# EAGLE schematic AK4493-Combi9 (EAGLE 9.6.2)
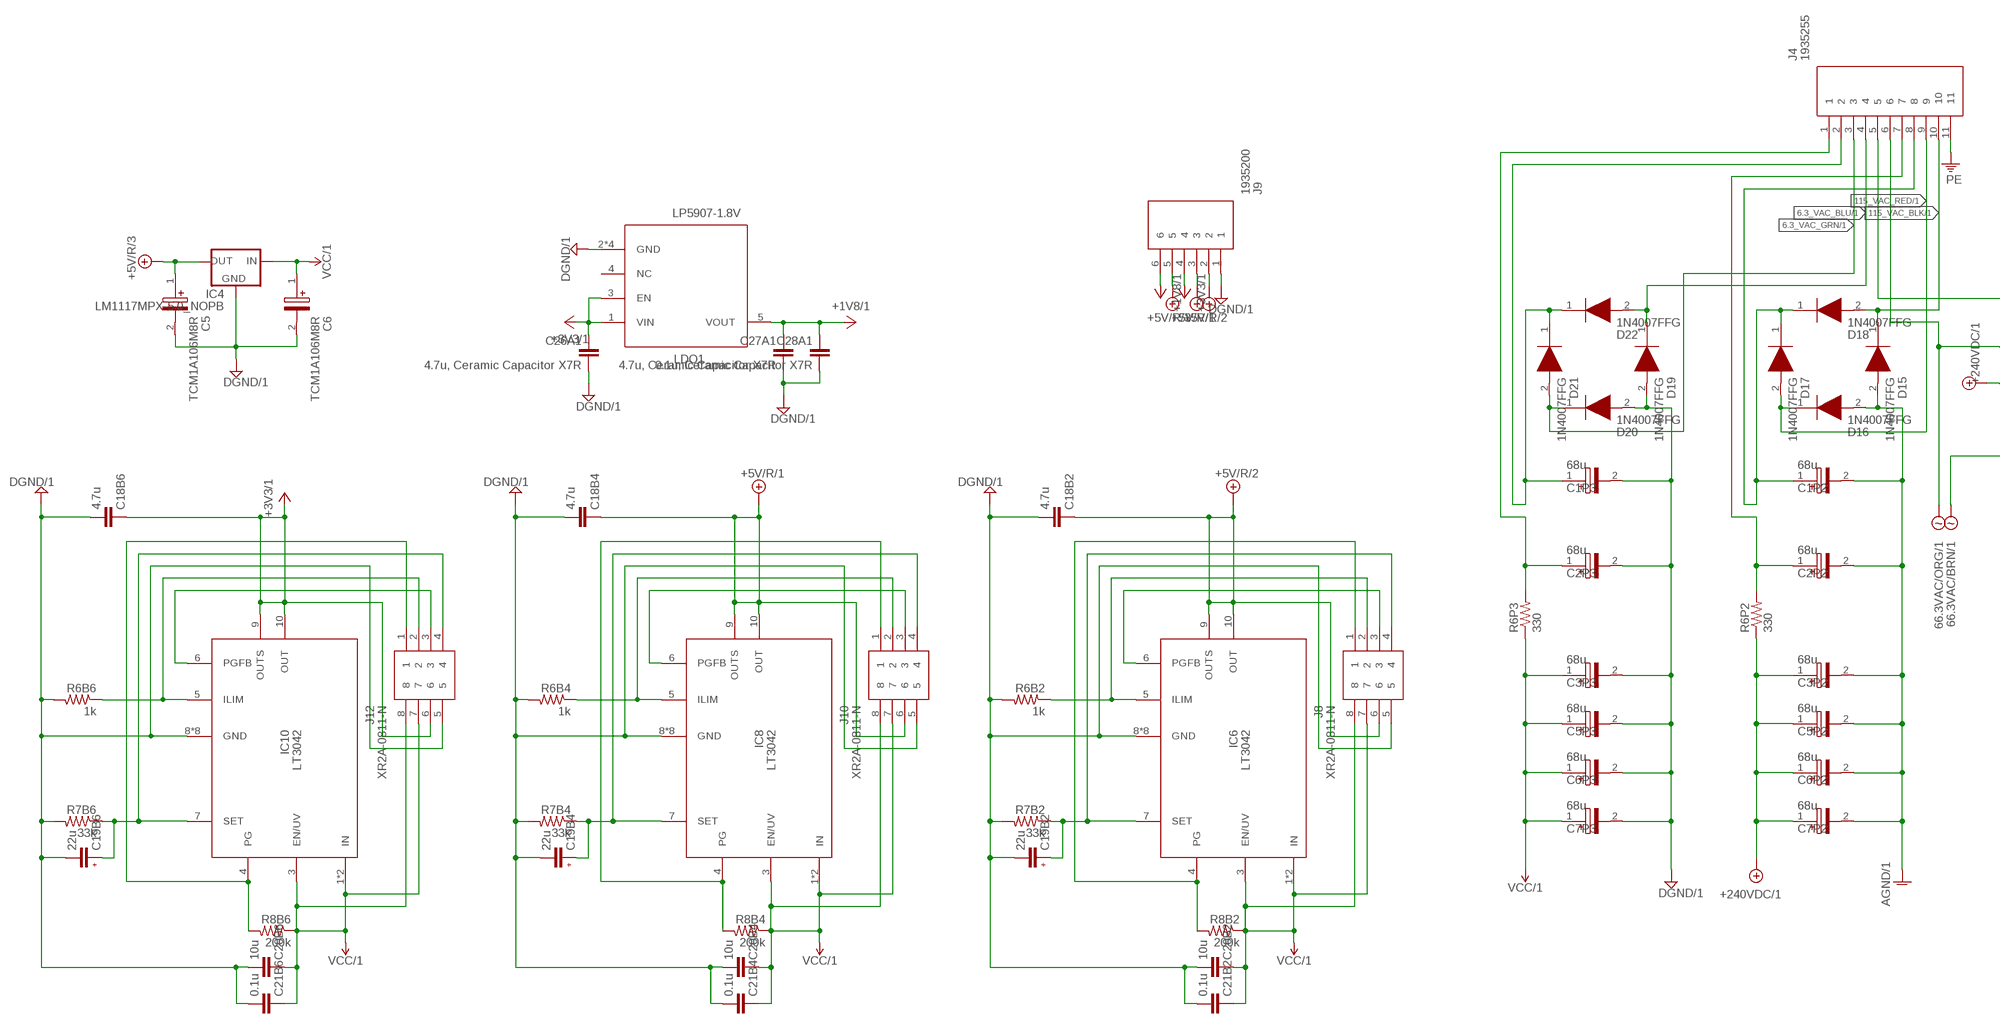
[diagram p0: schematic, sheet 1, part 1 of 3]
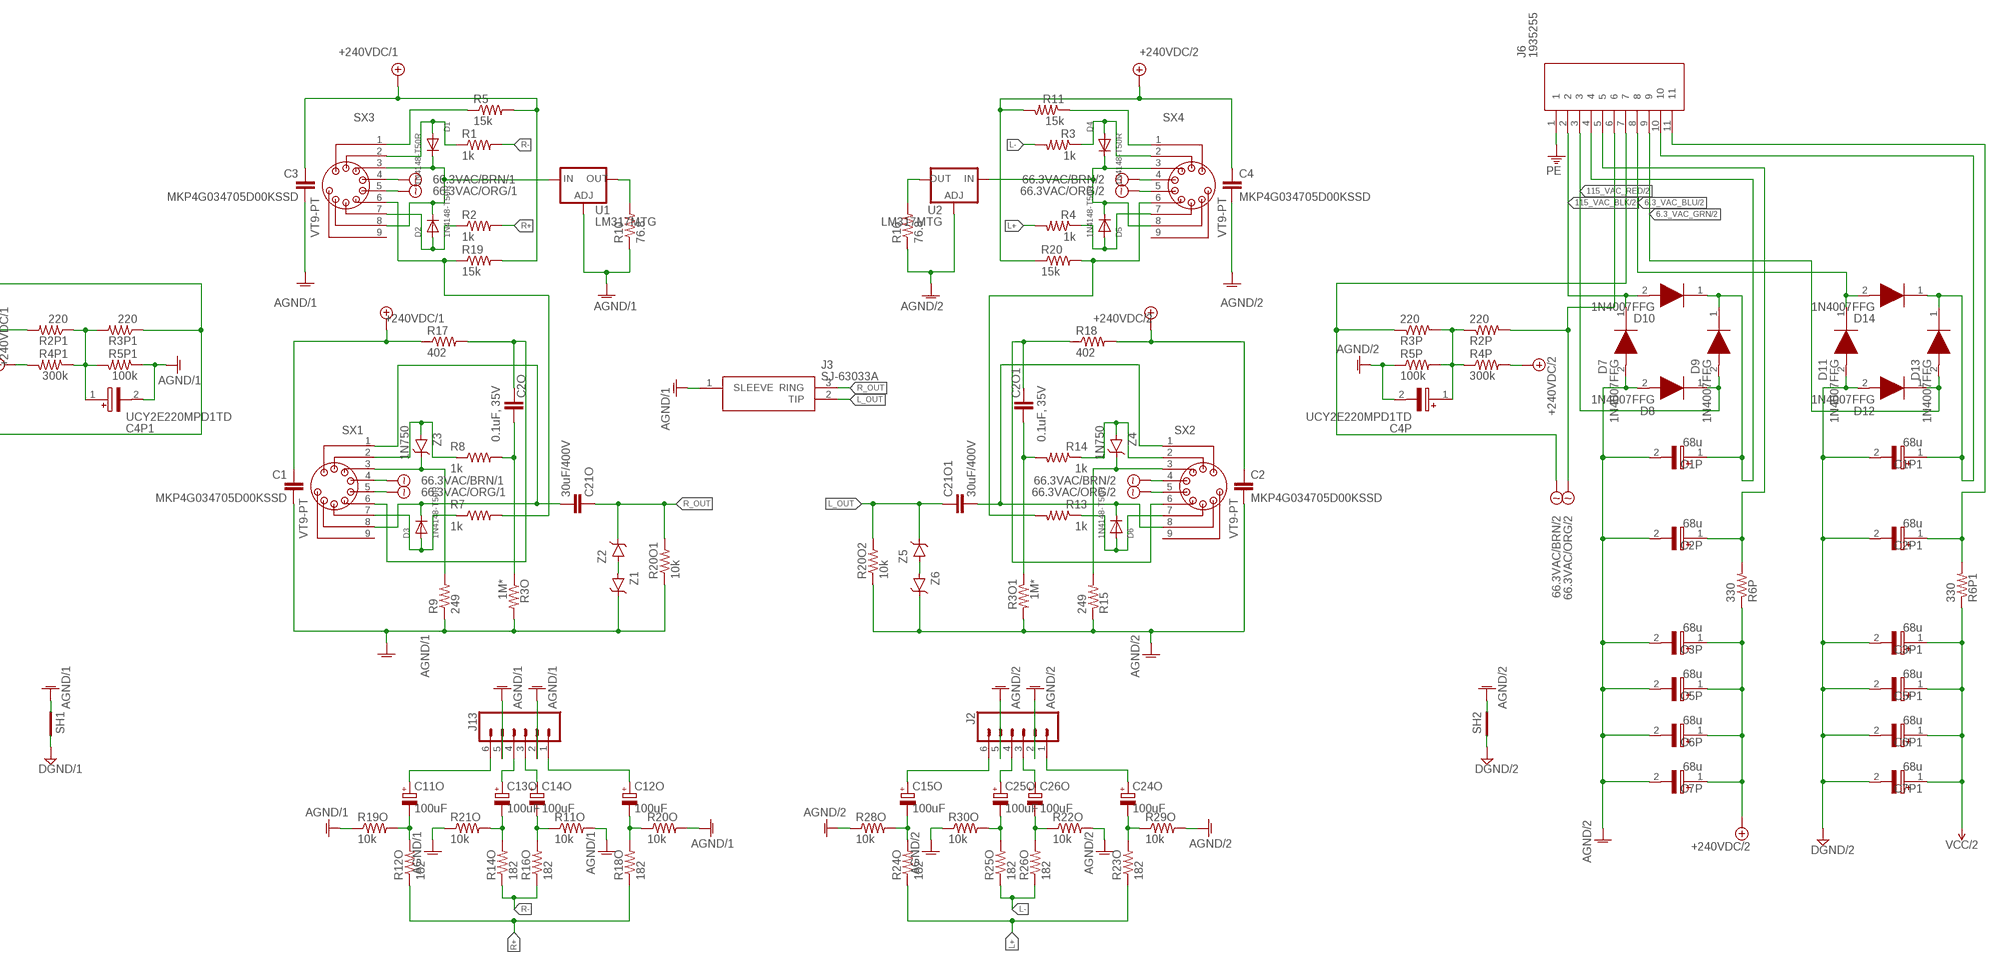
[diagram p1: schematic, sheet 1, part 2 of 3]
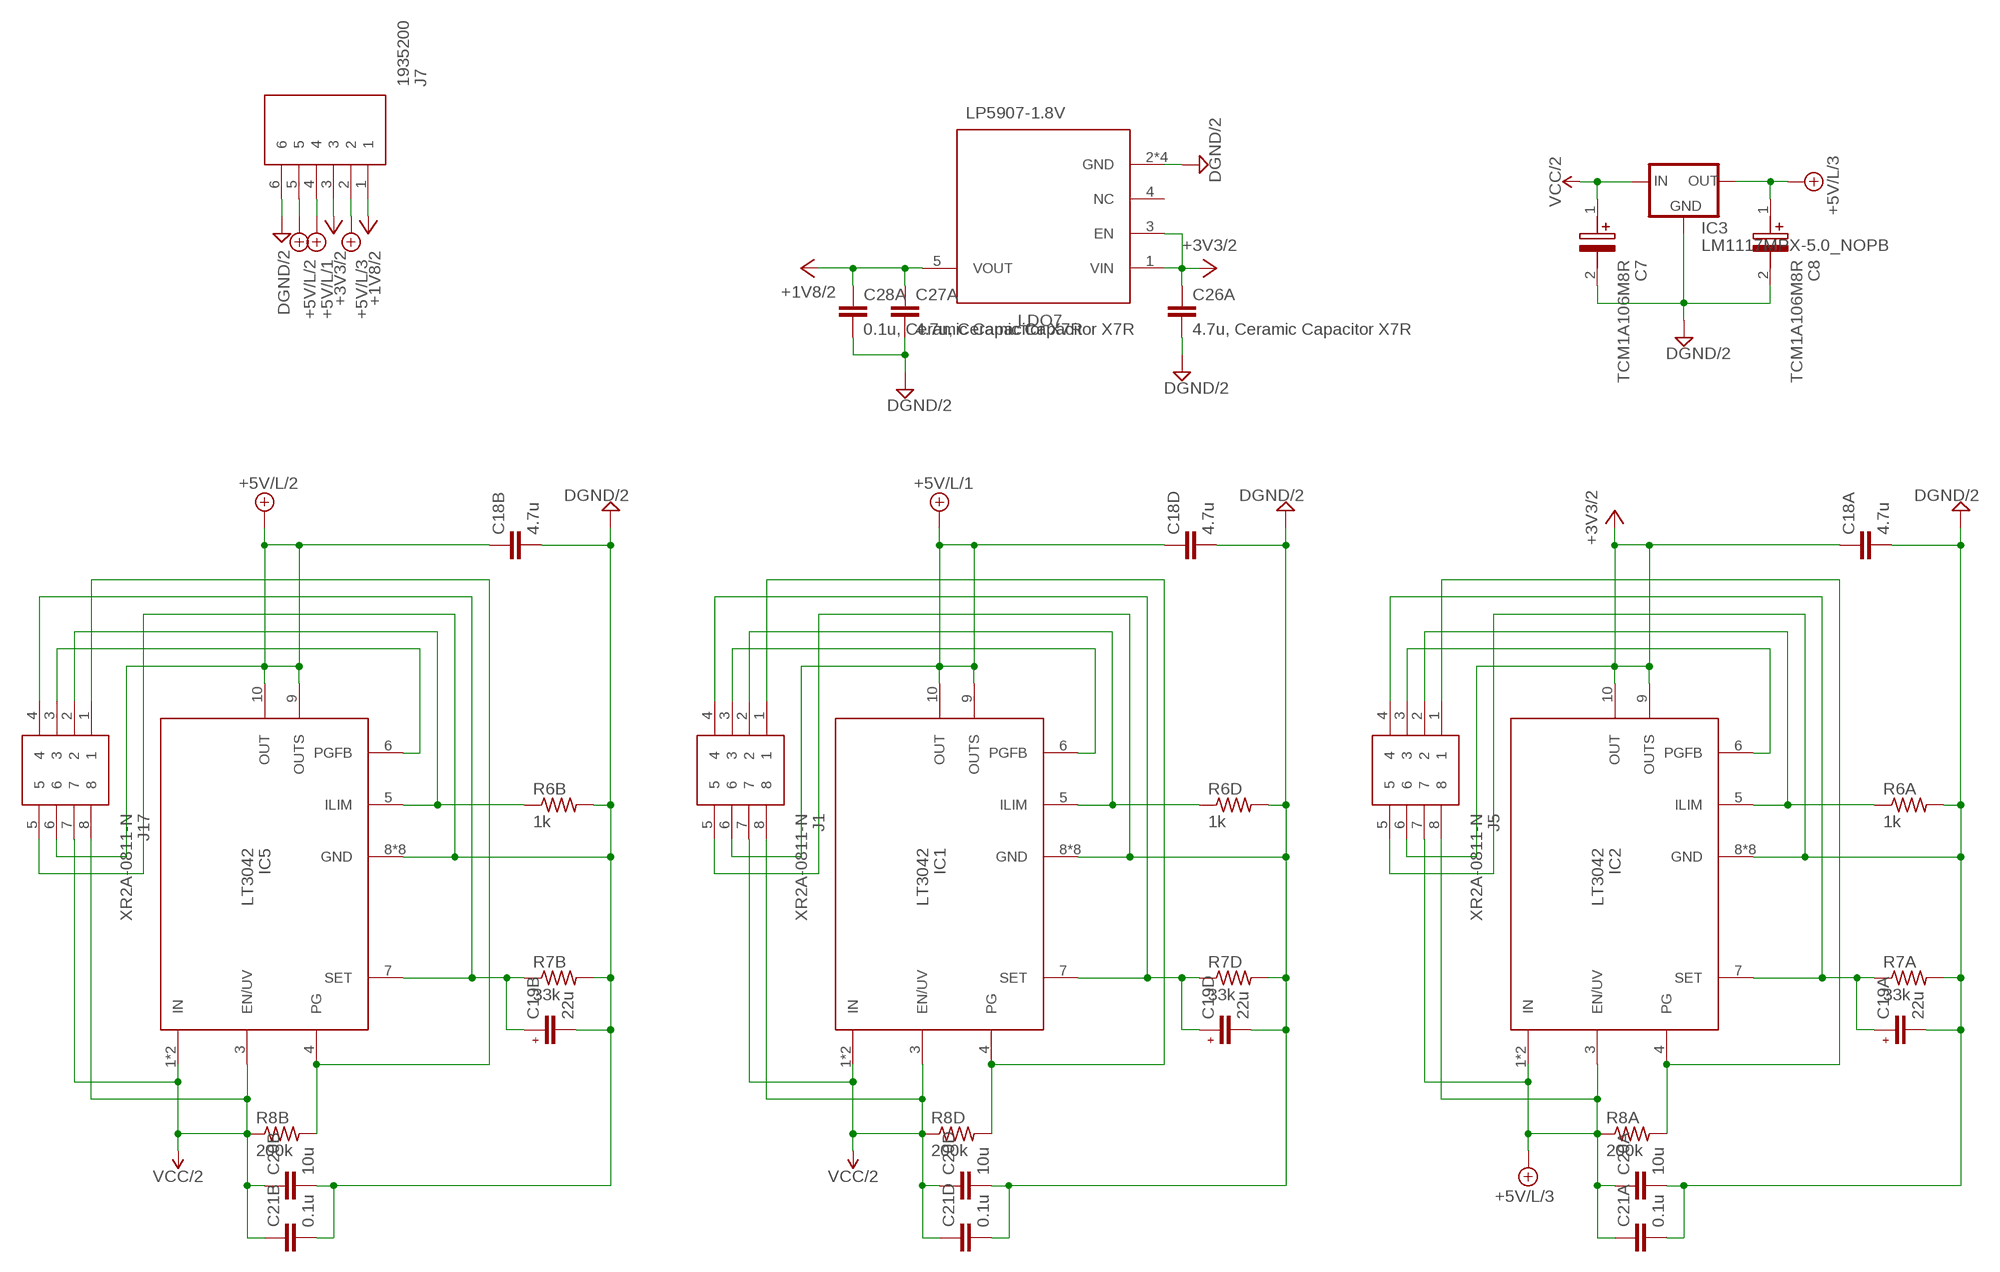
[diagram p2: schematic, sheet 1, part 3 of 3]

## Parts
C1  MKP4G034705D00KSSD  [MKP4G034705D00KSSD]
C1P  68u  500HXW68MEFR14.5X45  [CAPPRD750W80D1475H4700]
C1P1  68u  500HXW68MEFR14.5X45  [CAPPRD750W80D1475H4700]
C1P2  68u  500HXW68MEFR14.5X45  [CAPPRD750W80D1475H4700]
C1P3  68u  500HXW68MEFR14.5X45  [CAPPRD750W80D1475H4700]
C2  MKP4G034705D00KSSD  [MKP4G034705D00KSSD]
C2O  0.1uF, 35V  MKS4B031002A00JC00  [MKS4B031002A00JC00]
C2O1  0.1uF, 35V  MKS4B031002A00JC00  [MKS4B031002A00JC00]
C2P  68u  500HXW68MEFR14.5X45  [CAPPRD750W80D1475H4700]
C2P1  68u  500HXW68MEFR14.5X45  [CAPPRD750W80D1475H4700]
C2P2  68u  500HXW68MEFR14.5X45  [CAPPRD750W80D1475H4700]
C2P3  68u  500HXW68MEFR14.5X45  [CAPPRD750W80D1475H4700]
C3  MKP4G034705D00KSSD  [MKP4G034705D00KSSD]
C3P  68u  500HXW68MEFR14.5X45  [CAPPRD750W80D1475H4700]
C3P1  68u  500HXW68MEFR14.5X45  [CAPPRD750W80D1475H4700]
C3P2  68u  500HXW68MEFR14.5X45  [CAPPRD750W80D1475H4700]
C3P3  68u  500HXW68MEFR14.5X45  [CAPPRD750W80D1475H4700]
C4  MKP4G034705D00KSSD  [MKP4G034705D00KSSD]
C4P  UCY2E220MPD1TD  [CAPPRD500W60D1025H1750]
C4P1  UCY2E220MPD1TD  [CAPPRD500W60D1025H1750]
C5  TCM1A106M8R  [CAPPM168X90N]
C5P  68u  500HXW68MEFR14.5X45  [CAPPRD750W80D1475H4700]
C5P1  68u  500HXW68MEFR14.5X45  [CAPPRD750W80D1475H4700]
C5P2  68u  500HXW68MEFR14.5X45  [CAPPRD750W80D1475H4700]
C5P3  68u  500HXW68MEFR14.5X45  [CAPPRD750W80D1475H4700]
C6  TCM1A106M8R  [CAPPM168X90N]
C6P  68u  500HXW68MEFR14.5X45  [CAPPRD750W80D1475H4700]
C6P1  68u  500HXW68MEFR14.5X45  [CAPPRD750W80D1475H4700]
C6P2  68u  500HXW68MEFR14.5X45  [CAPPRD750W80D1475H4700]
C6P3  68u  500HXW68MEFR14.5X45  [CAPPRD750W80D1475H4700]
C7  TCM1A106M8R  [CAPPM168X90N]
C7P  68u  500HXW68MEFR14.5X45  [CAPPRD750W80D1475H4700]
C7P1  68u  500HXW68MEFR14.5X45  [CAPPRD750W80D1475H4700]
C7P2  68u  500HXW68MEFR14.5X45  [CAPPRD750W80D1475H4700]
C7P3  68u  500HXW68MEFR14.5X45  [CAPPRD750W80D1475H4700]
C8  TCM1A106M8R  [CAPPM168X90N]
C11O  100uF  UFW1H101MPD1TD  [CAPPRD350W60D825H1300]
C12O  100uF  UFW1H101MPD1TD  [CAPPRD350W60D825H1300]
C13O  100uF  UFW1H101MPD1TD  [CAPPRD350W60D825H1300]
C14O  100uF  UFW1H101MPD1TD  [CAPPRD350W60D825H1300]
C15O  100uF  UFW1H101MPD1TD  [CAPPRD350W60D825H1300]
C18A  4.7u  EMK212ABJ475KG-T  [CAPC2013X140N]
C18B  4.7u  EMK212ABJ475KG-T  [CAPC2013X140N]
C18B2  4.7u  EMK212ABJ475KG-T  [CAPC2013X140N]
C18B4  4.7u  EMK212ABJ475KG-T  [CAPC2013X140N]
C18B6  4.7u  EMK212ABJ475KG-T  [CAPC2013X140N]
C18D  4.7u  EMK212ABJ475KG-T  [CAPC2013X140N]
C19A  22u  EMK316BB7226ML-T  [C1206]
C19B  22u  EMK316BB7226ML-T  [C1206]
C19B2  22u  EMK316BB7226ML-T  [C1206]
C19B4  22u  EMK316BB7226ML-T  [C1206]
C19B6  22u  EMK316BB7226ML-T  [C1206]
C19D  22u  EMK316BB7226ML-T  [C1206]
C20A  10u  EMK212BB7106KG-T  [CAPC2012X135N]
C20B  10u  EMK212BB7106KG-T  [CAPC2012X135N]
C20B2  10u  EMK212BB7106KG-T  [CAPC2012X135N]
C20B4  10u  EMK212BB7106KG-T  [CAPC2012X135N]
C20B6  10u  EMK212BB7106KG-T  [CAPC2012X135N]
C20D  10u  EMK212BB7106KG-T  [CAPC2012X135N]
C21A  0.1u  EMF212B7104KGHT  [CAPC2012X135N]
C21B  0.1u  EMF212B7104KGHT  [CAPC2012X135N]
C21B2  0.1u  EMF212B7104KGHT  [CAPC2012X135N]
C21B4  0.1u  EMF212B7104KGHT  [CAPC2012X135N]
C21B6  0.1u  EMF212B7104KGHT  [CAPC2012X135N]
C21D  0.1u  EMF212B7104KGHT  [CAPC2012X135N]
C21O  30uF/400V  DCP4G056007GD4KSSD  [DCP4G056007GD4KSSD]
C21O1  30uF/400V  DCP4G056007GD4KSSD  [DCP4G056007GD4KSSD]
C24O  100uF  UFW1H101MPD1TD  [CAPPRD350W60D825H1300]
C25O  100uF  UFW1H101MPD1TD  [CAPPRD350W60D825H1300]
C26A  4.7u, Ceramic Capacitor X7R  EMK212ABJ475KG-T  [CAPC2013X140N]
C26A1  4.7u, Ceramic Capacitor X7R  EMK212ABJ475KG-T  [CAPC2013X140N]
C26O  100uF  UFW1H101MPD1TD  [CAPPRD350W60D825H1300]
C27A  4.7u, Ceramic Capacitor X7R  EMK212ABJ475KG-T  [CAPC2013X140N]
C27A1  4.7u, Ceramic Capacitor X7R  EMK212ABJ475KG-T  [CAPC2013X140N]
C28A  0.1u, Ceramic Capacitor X7R  EMF212B7104KGHT  [CAPC2012X135N]
C28A1  0.1u, Ceramic Capacitor X7R  EMF212B7104KGHT  [CAPC2012X135N]
D1  1N4148-T50R  [DIOAD1068W53L380D172]
D2  1N4148-T50R  [DIOAD1068W53L380D172]
D3  1N4148-T50R  [DIOAD1068W53L380D172]
D4  1N4148-T50R  [DIOAD1068W53L380D172]
D5  1N4148-T50R  [DIOAD1068W53L380D172]
D6  1N4148-T50R  [DIOAD1068W53L380D172]
D7  1N4007FFG  [DIOAD1405W86L465D235]
D8  1N4007FFG  [DIOAD1405W86L465D235]
D9  1N4007FFG  [DIOAD1405W86L465D235]
D10  1N4007FFG  [DIOAD1405W86L465D235]
D11  1N4007FFG  [DIOAD1405W86L465D235]
D12  1N4007FFG  [DIOAD1405W86L465D235]
D13  1N4007FFG  [DIOAD1405W86L465D235]
D14  1N4007FFG  [DIOAD1405W86L465D235]
D15  1N4007FFG  [DIOAD1405W86L465D235]
D16  1N4007FFG  [DIOAD1405W86L465D235]
D17  1N4007FFG  [DIOAD1405W86L465D235]
D18  1N4007FFG  [DIOAD1405W86L465D235]
D19  1N4007FFG  [DIOAD1405W86L465D235]
D20  1N4007FFG  [DIOAD1405W86L465D235]
D21  1N4007FFG  [DIOAD1405W86L465D235]
D22  1N4007FFG  [DIOAD1405W86L465D235]
IC1  LT3042  [SOP50P490X110-11N]
IC2  LT3042  [SOP50P490X110-11N]
IC3  LM1117MPX-5.0_NOPB  [SOT230P700X180-4N]
IC4  LM1117MPX-5.0_NOPB  [SOT230P700X180-4N]
IC5  LT3042  [SOP50P490X110-11N]
IC6  LT3042  [SOP50P490X110-11N]
IC8  LT3042  [SOP50P490X110-11N]
IC10  LT3042  [SOP50P490X110-11N]
J1  XR2A-0811-N  [DIPS762W51P254L1016H390Q8N]
J2  CONN_06SILK_FEMALE_PTH  [1X06]
J3  SJ-63033A  [SJ63033A]
J4  1935255  [1935255]
J5  XR2A-0811-N  [DIPS762W51P254L1016H390Q8N]
J6  1935255  [1935255]
J7  1935200  [1935200]
J8  XR2A-0811-N  [DIPS762W51P254L1016H390Q8N]
J9  1935200  [1935200]
J10  XR2A-0811-N  [DIPS762W51P254L1016H390Q8N]
J12  XR2A-0811-N  [DIPS762W51P254L1016H390Q8N]
J13  CONN_06SILK_FEMALE_PTH  [1X06]
J17  XR2A-0811-N  [DIPS762W51P254L1016H390Q8N]
LDO1  LP5907-1.8V  [SOT95P280X145-5N]
LDO7  LP5907-1.8V  [SOT95P280X145-5N]
R1  1k  LR1F1K0  [0207/10]
R2  1k  LR1F1K0  [0207/10]
R2P  220  R-US_0411/15  [0411/15]
R2P1  220  R-US_0411/15  [0411/15]
R3  1k  LR1F1K0  [0207/10]
R3O  1M*  LR1F1M0  [0207/10]
R3O1  1M*  LR1F1M0  [0207/10]
R3P  220  R-US_0411/15  [0411/15]
R3P1  220  R-US_0411/15  [0411/15]
R4  1k  LR1F1K0  [0207/10]
R4P  300k  R-US_0411/15  [0411/15]
R4P1  300k  R-US_0411/15  [0411/15]
R5  15k  CPF215K000FKE14  [0411/15]
R5P  100k  R-US_0411/15  [0411/15]
R5P1  100k  R-US_0411/15  [0411/15]
R6A  1k  CHP0805-FX-1001ELF  [RESC2012X60N]
R6B  1k  CHP0805-FX-1001ELF  [RESC2012X60N]
R6B2  1k  CHP0805-FX-1001ELF  [RESC2012X60N]
R6B4  1k  CHP0805-FX-1001ELF  [RESC2012X60N]
R6B6  1k  CHP0805-FX-1001ELF  [RESC2012X60N]
R6D  1k  CHP0805-FX-1001ELF  [RESC2012X60N]
R6P  330  R-US_0411/15  [0411/15]
R6P1  330  R-US_0411/15  [0411/15]
R6P2  330  R-US_0411/15  [0411/15]
R6P3  330  R-US_0411/15  [0411/15]
R7  1k  LR1F1K0  [0207/10]
R7A  33k  CPF0805B51KE1  [R0805]
R7B  33k  CPF0805B51KE1  [R0805]
R7B2  33k  CPF0805B51KE1  [R0805]
R7B4  33k  CPF0805B51KE1  [R0805]
R7B6  33k  CPF0805B51KE1  [R0805]
R7D  33k  CPF0805B51KE1  [R0805]
R8  1k  LR1F1K0  [0207/10]
R8A  200k  RR1220P-204-D  [R0805]
R8B  200k  RR1220P-204-D  [R0805]
R8B2  200k  RR1220P-204-D  [R0805]
R8B4  200k  RR1220P-204-D  [R0805]
R8B6  200k  RR1220P-204-D  [R0805]
R8D  200k  RR1220P-204-D  [R0805]
R9  249  MBB02070C2490FRP00  [0207/10]
R10  76.8  YR1B76R8CC  [0207/10]
R11  15k  CPF215K000FKE14  [0411/15]
R11O  10k  LR1F10K  [0207/10]
R12O  182  MF0207FTE52-182R  [0207/10]
R13  1k  LR1F1K0  [0207/10]
R14  1k  LR1F1K0  [0207/10]
R14O  182  MF0207FTE52-182R  [0207/10]
R15  249  MBB02070C2490FRP00  [0207/10]
R16  76.8  YR1B76R8CC  [0207/10]
R16O  182  MF0207FTE52-182R  [0207/10]
R17  402  RWR80S4020FRB12  [0617/22]
R18  402  RWR80S4020FRB12  [0617/22]
R18O  182  MF0207FTE52-182R  [0207/10]
R19  15k  CPF215K000FKE14  [0411/15]
R19O  10k  LR1F10K  [0207/10]
R20  15k  CPF215K000FKE14  [0411/15]
R20O  10k  LR1F10K  [0207/10]
R20O1  10k  LR1F10K  [0207/10]
R20O2  10k  LR1F10K  [0207/10]
R21O  10k  LR1F10K  [0207/10]
R22O  10k  LR1F10K  [0207/10]
R23O  182  MF0207FTE52-182R  [0207/10]
R24O  182  MF0207FTE52-182R  [0207/10]
R25O  182  MF0207FTE52-182R  [0207/10]
R26O  182  MF0207FTE52-182R  [0207/10]
R28O  10k  LR1F10K  [0207/10]
R29O  10k  LR1F10K  [0207/10]
R30O  10k  LR1F10K  [0207/10]
SH1  SHORTA5  [SHORT_ALL-50]
SH2  SHORTA5  [SHORT_ALL-50]
SX1  VT9-PT  [VT9-PT]
SX2  VT9-PT  [VT9-PT]
SX3  VT9-PT  [VT9-PT]
SX4  VT9-PT  [VT9-PT]
U1  LM317MTG  [TO254P482X997X2018-3P]
U2  LM317MTG  [TO254P482X997X2018-3P]
Z1  BZX79-C16,113  [DIOAD1165W56L425D185]
Z2  BZX79-C16,113  [DIOAD1165W56L425D185]
Z3  1N750  [DIOAD1256W56L444D203]
Z4  1N750  [DIOAD1256W56L444D203]
Z5  BZX79-C16,113  [DIOAD1165W56L425D185]
Z6  BZX79-C16,113  [DIOAD1165W56L425D185]

## Nets
6.3_VAC_BLU/1: D19.1(K) D22.2(A) J4.4
6.3_VAC_BLU/2: D11.1(K) D14.2(A) J6.8
6.3_VAC_GRN/1: D20.1(K) D21.2(A) J4.3
6.3_VAC_GRN/2: D12.1(K) D13.2(A) J6.9
66.3VAC/BRN/1: J4.5 R3P1.1 SX1.4 SX3.4
66.3VAC/BRN/2: J6.7 R3P.1 SX2.4 SX4.4
66.3VAC/ORG/1: J4.6 R2P1.2 SX1.5 SX3.5
66.3VAC/ORG/2: J6.6 R2P.2 SX2.5 SX4.5
115_VAC_BLK/1: D15.1(K) D18.2(A) J4.10
115_VAC_BLK/2: D7.1(K) D10.2(A) J6.2
115_VAC_RED/1: D16.1(K) D17.2(A) J4.9
115_VAC_RED/2: D8.1(K) D9.2(A) J6.3
+1V8/1: C27A1.1 C28A1.1 J9.6 LDO1.5(VOUT)
+1V8/2: C27A.1 C28A.1 J7.1 LDO7.5(VOUT)
+3V3/1: C18B6.1 C26A1.1 IC10.9(OUTS) IC10.10(OUT) J9.4 J12.6 LDO1.1(VIN) LDO1.3(EN)
+3V3/2: C18A.1 C26A.1 IC2.9(OUTS) IC2.10(OUT) J5.6 J7.3 LDO7.1(VIN) LDO7.3(EN)
+5V/L/1: C18D.1 IC1.9(OUTS) IC1.10(OUT) J1.6 J7.4
+5V/L/2: C18B.1 IC5.9(OUTS) IC5.10(OUT) J7.5 J17.6
+5V/L/3: C8.1(+) C20A.1 C21A.1 IC2.1(IN) IC2.2(IN) IC2.3(EN/UV) IC3.2(OUT) IC3.4(OUT) J5.7 J5.8 J7.2 R8A.1
+5V/R/1: C18B4.1 IC8.9(OUTS) IC8.10(OUT) J9.3 J10.6
+5V/R/2: C18B2.1 IC6.9(OUTS) IC6.10(OUT) J8.6 J9.2
+5V/R/3: C5.1(+) IC4.2(OUT) IC4.4(OUT) J9.5
+240VDC/1: C1.1 C3.1 C3P2.1(+) C5P2.1(+) C6P2.1(+) C7P2.1(+) R4P1.2 R5.2 R6P2.1 R17.1 R19.2
+240VDC/2: C2.1 C3P.1(+) C4.1 C5P.1(+) C6P.1(+) C7P.1(+) R4P.2 R6P.1 R11.2 R18.2 R20.1
AGND/1: C1.2 C1P2.2(-) C2P2.2(-) C3.2 C3P2.2(-) C4P1.2(-) C5P2.2(-) C6P2.2(-) C7P2.2(-) D15.2(A) D16.2(A) J3.1(SLEEVE) J13.2 J13.5 R3O.2 R5P1.1 R9.1 R10.1 R11O.2 R19O.1 R20O1.1 R20O.2 R21O.1 SH1.2 U1.1(ADJ) Z1.1(C)
AGND/2: C1P.2(-) C2.2 C2P.2(-) C3P.2(-) C4.2 C4P.2(-) C5P.2(-) C6P.2(-) C7P.2(-) D7.2(A) D8.2(A) J2.2 J2.5 R3O1.2 R5P.1 R15.1 R16.1 R20O2.1 R22O.2 R28O.1 R29O.2 R30O.1 SH2.2 U2.1(ADJ) Z6.1(C)
DGND/1: C1P3.2(-) C2P3.2(-) C3P3.2(-) C5.2(-) C5P3.2(-) C6.2(-) C6P3.2(-) C7P3.2(-) C18B2.2 C18B4.2 C18B6.2 C19B2.2 C19B2.DGND C19B4.2 C19B4.DGND C19B6.2 C19B6.DGND C20B2.2 C20B4.2 C20B6.2 C21B2.2 C21B4.2 C21B6.2 C26A1.2 C27A1.2 C28A1.2 D19.2(A) D20.2(A) IC4.1(GND) IC6.8(GND) IC6.11(GND) IC6.P$1(GND) IC6.P$2(GND) IC6.P$3(GND) IC6.P$4(GND) IC6.P$5(GND) IC6.P$6(GND) IC8.8(GND) IC8.11(GND) IC8.P$1(GND) IC8.P$2(GND) IC8.P$3(GND) IC8.P$4(GND) IC8.P$5(GND) IC8.P$6(GND) IC10.8(GND) IC10.11(GND) IC10.P$1(GND) IC10.P$2(GND) IC10.P$3(GND) IC10.P$4(GND) IC10.P$5(GND) IC10.P$6(GND) J8.5 J9.1 J10.5 J12.5 LDO1.2(GND) LDO1.DGND2(GND) LDO1.DGND3(GND) LDO1.DGND(GND) R6B2.2 R6B4.2 R6B6.2 R7B2.2 R7B4.2 R7B6.2 SH1.1
DGND/2: C1P1.2(-) C2P1.2(-) C3P1.2(-) C5P1.2(-) C6P1.2(-) C7.2(-) C7P1.2(-) C8.2(-) C18A.2 C18B.2 C18D.2 C19A.2 C19A.DGND C19B.2 C19B.DGND C19D.2 C19D.DGND C20A.2 C20B.2 C20D.2 C21A.2 C21B.2 C21D.2 C26A.2 C27A.2 C28A.2 D11.2(A) D12.2(A) IC1.8(GND) IC1.11(GND) IC1.P$1(GND) IC1.P$2(GND) IC1.P$3(GND) IC1.P$4(GND) IC1.P$5(GND) IC1.P$6(GND) IC2.8(GND) IC2.11(GND) IC2.P$1(GND) IC2.P$2(GND) IC2.P$3(GND) IC2.P$4(GND) IC2.P$5(GND) IC2.P$6(GND) IC3.1(GND) IC5.8(GND) IC5.11(GND) IC5.P$1(GND) IC5.P$2(GND) IC5.P$3(GND) IC5.P$4(GND) IC5.P$5(GND) IC5.P$6(GND) J1.5 J5.5 J7.6 J17.5 LDO7.2(GND) LDO7.DGND2(GND) LDO7.DGND3(GND) LDO7.DGND(GND) R6A.2 R6B.2 R6D.2 R7A.2 R7B.2 R7D.2 SH2.1
L+ [Signal]: R4.2 R23O.1 R24O.1
L- [Signal]: R3.2 R25O.1 R26O.1
L_OUT [Signal]: C21O1.1 C21O1.4 J3.2(TIP) R20O2.2 Z5.1(C)
N$1: R7.2 R19.1 SX3.6
N$2: R8.1 SX1.2 Z3.2(A)
N$3: C21O1.2 C21O1.3 D6.1(C) SX2.1 SX2.8
N$4: D4.2(A) R3.1 SX4.2
N$5: D5.2(A) R4.1 SX4.7
N$6: D1.2(A) R1.1 SX3.2
N$7 [Power]: D4.1(C) D5.1(C) SX4.3 SX4.8 U2.3(IN)
N$8: R11.1 SX4.1
N$9: R13.2 R20.2 SX4.6
N$10: C11O.1(+) J13.6
N$11: C11O.2(-) R12O.2 R19O.2
N$12: C15O.1(+) J2.6
N$13: D2.2(A) R2.1 SX3.7
N$14: R14.1 SX2.2 Z4.2(A)
N$15: C12O.1(+) J13.1
N$16: C2O.2 R3O.1 R8.2
N$17: C2O1.2 R3O1.1 R14.2
N$18: C21O.2 C21O.3 D3.1(C) SX1.1 SX1.8
N$19: C12O.2(-) R18O.2 R20O.1
N$20: C15O.2(-) R24O.2 R28O.2
N$21: C13O.1(+) J13.4
N$22 [Power]: D1.1(C) D2.1(C) SX3.3 SX3.8 U1.3(IN)
N$23: D3.2(A) R7.1 SX1.7
N$24: C14O.1(+) J13.3
N$25: C14O.2(-) R11O.1 R16O.2
N$26: R9.2 SX1.3 Z3.1(C)
N$27: R15.2 SX2.3 Z4.1(C)
N$28: C13O.2(-) R14O.2 R21O.2
N$29: D6.2(A) R13.1 SX2.7
N$30: C24O.1(+) J2.1
N$31: C24O.2(-) R23O.2 R29O.1
N$32: C25O.1(+) J2.4
N$33: C26O.1(+) J2.3
N$34: C26O.2(-) R22O.1 R26O.2
N$35: R5.1 SX3.1
N$36: C25O.2(-) R25O.2 R30O.2
N$37: R10.2 U1.2(OUT)
N$38: R16.2 U2.2(OUT)
N$39 [Power]: C2O.1 R17.2 SX1.6
N$40 [Power]: C2O1.1 R18.1 SX2.6
N$41: Z1.2(A) Z2.2(A)
N$42: Z5.2(A) Z6.2(A)
N$43: C1P.1(+) D9.1(K) D10.1(K) J6.4
N$44: C2P.1(+) J6.5 R6P.2
N$45: C4P.1(+) R2P.1 R3P.2 R4P.1 R5P.2
N$46: IC5.4(PG) J17.1 R8B.2
N$47: IC5.5(ILIM) J17.2 R6B.1
N$48: IC5.6(PGFB) J17.3
N$49: IC1.4(PG) J1.1 R8D.2
N$50: IC1.5(ILIM) J1.2 R6D.1
N$51: IC1.6(PGFB) J1.3
N$52: C19D.1 IC1.7(SET) J1.4 R7D.1
N$53: IC2.4(PG) J5.1 R8A.2
N$54: IC2.5(ILIM) J5.2 R6A.1
N$55: IC2.6(PGFB) J5.3
N$56: C19A.1 IC2.7(SET) J5.4 R7A.1
N$57: C1P1.1(+) D13.1(K) D14.1(K) J6.10
N$58: C2P1.1(+) J6.11 R6P1.2
N$59: C1P2.1(+) D17.1(K) D18.1(K) J4.8
N$60: C2P2.1(+) J4.7 R6P2.2
N$61: C4P1.1(+) R2P1.1 R3P1.2 R4P1.1 R5P1.2
N$62: C1P3.1(+) D21.1(K) D22.1(K) J4.2
N$63: IC6.4(PG) J8.1 R8B2.2
N$64: C19B2.1 IC6.7(SET) J8.4 R7B2.1
N$65: IC6.5(ILIM) J8.2 R6B2.1
N$66: IC6.6(PGFB) J8.3
N$67: C2P3.1(+) J4.1 R6P3.2
N$71: IC8.4(PG) J10.1 R8B4.2
N$72: C19B4.1 IC8.7(SET) J10.4 R7B4.1
N$73: IC8.5(ILIM) J10.2 R6B4.1
N$74: IC8.6(PGFB) J10.3
N$79: IC10.4(PG) J12.1 R8B6.2
N$80: C19B6.1 IC10.7(SET) J12.4 R7B6.1
N$81: IC10.5(ILIM) J12.2 R6B6.1
N$82: IC10.6(PGFB) J12.3
N$103: C19B.1 IC5.7(SET) J17.4 R7B.1
PE: J4.11 J6.1
R+ [Signal]: R2.2 R12O.1 R18O.1
R- [Signal]: R1.2 R14O.1 R16O.1
R_OUT [Signal]: C21O.1 C21O.4 J3.3(RING) R20O1.2 Z2.1(C)
VCC/1: C3P3.1(+) C5P3.1(+) C6.1(+) C6P3.1(+) C7P3.1(+) C20B2.1 C20B4.1 C20B6.1 C21B2.1 C21B4.1 C21B6.1 IC4.3(IN) IC6.1(IN) IC6.2(IN) IC6.3(EN/UV) IC8.1(IN) IC8.2(IN) IC8.3(EN/UV) IC10.1(IN) IC10.2(IN) IC10.3(EN/UV) J8.7 J8.8 J10.7 J10.8 J12.7 J12.8 R6P3.1 R8B2.1 R8B4.1 R8B6.1
VCC/2: C3P1.1(+) C5P1.1(+) C6P1.1(+) C7.1(+) C7P1.1(+) C20B.1 C20D.1 C21B.1 C21D.1 IC1.1(IN) IC1.2(IN) IC1.3(EN/UV) IC3.3(IN) IC5.1(IN) IC5.2(IN) IC5.3(EN/UV) J1.7 J1.8 J17.7 J17.8 R6P1.1 R8B.1 R8D.1
Unconnected: LDO1.4(NC) LDO7.4(NC) SX1.9 SX2.9 SX3.9 SX4.9

## Library data of the parts
C1-C4 = Dual Mono Amp Library:MKP4G034705D00KSSD: 0.47 F Film Capacitor 220V 400V Polypropylene (PP), Metallized Radial Source: Datasheet; DESCRIPTION: 0.47 F Film Capacitor 220V 400V Polypropylene (PP), Metallized Radial; HEIGHT: 16.5mm; MANUFACTURER_NAME: WIMA; MANUFACTURER_PART_NUMBER: MKP4G034705D00KSSD; MOUSER_PART_NUMBER: 505-MKP4G034705DKSSD; MOUSER_PRICE-STOCK: http://www.mouser.com/Search/ProductDetail.aspx?qs=sJjjjplDs9uaOctv9bTMfA%3d%3d
C1P C1P1-C1P3 C2P C2P1-C2P3 C3P C3P1-C3P3 C5P C5P1-C5P3 C6P C6P1-C6P3 C7P C7P1-C7P3 = 500HXW68MEFR14.5X45:500HXW68MEFR14.5X45: Aluminum Electrolytic Capacitors - Radial Leaded GENERAL PURPOSE ELECTROLYTIC CAPACITORS Source: Datasheet; DESCRIPTION: Aluminum Electrolytic Capacitors - Radial Leaded GENERAL PURPOSE ELECTROLYTIC CAPACITORS; HEIGHT: 47mm; MANUFACTURER_NAME: Rubycon; MANUFACTURER_PART_NUMBER: 500HXW68MEFR14.5X45
C2O C2O1 = Dual Mono Amp Library:MKS4B031002A00JC00: Film Capacitors MKS 4 0.1 uF 50 VDC 2.5x7x10 PCM 7.5 Source: Datasheet; DESCRIPTION: Film Capacitors MKS 4 0.1 uF 50 VDC 2.5x7x10 PCM 7.5; HEIGHT: 7mm; MANUFACTURER_NAME: WIMA; MANUFACTURER_PART_NUMBER: MKS4B031002A00JC00; MOUSER_PART_NUMBER: 505-MKS4B0312AJC; MOUSER_PRICE-STOCK: https://www.mouser.co.uk/ProductDetail/WIMA/MKS4B031002A00JC00?qs=2G4irm%2FqADy9MV8AUfKNYA%3D%3D
C4P C4P1 = UCY2E220MPD1TD:UCY2E220MPD1TD: Aluminum Electrolytic Capacitors - Radial Leaded 22uF 250V 20% AEC-Q200 Source: Datasheet; DESCRIPTION: Aluminum Electrolytic Capacitors - Radial Leaded 22uF 250V 20% AEC-Q200; HEIGHT: 17.5mm; MANUFACTURER_NAME: Nichicon; MANUFACTURER_PART_NUMBER: UCY2E220MPD1TD; MOUSER_PART_NUMBER: 647-UCY2E220MPD1TD; MOUSER_PRICE-STOCK: https://www.mouser.co.uk/ProductDetail/Nichicon/UCY2E220MPD1TD?qs=JgOBn5pVFooNXIGMeLbPFg%3D%3D
C5-C8 = Dual Mono Amp Library:TCM1A106M8R: Tantalum Capacitors - Solid SMD 10 VDC 10 uF 0603 20 % ESR=9 mOhms Source: Datasheet; DESCRIPTION: Tantalum Capacitors - Solid SMD 10 VDC 10 uF 0603 20 % ESR=9 mOhms; HEIGHT: 0.9mm; MANUFACTURER_NAME: Kyocera AVX; MANUFACTURER_PART_NUMBER: TCM1A106M8R; MOUSER_PART_NUMBER: 755-TCM1A106M8R; MOUSER_PRICE-STOCK: https://www.mouser.co.uk/ProductDetail/KYOCERA-AVX/TCM1A106M8R?qs=Z4wLSx0Y7o51yvfoDMdJcQ%3D%3D
C11O C12O C13O C14O C15O C24O C25O C26O = Dual Mono Amp Library:UFW1H101MPD1TD: Aluminum Electrolytic Capacitors - Radial Leaded 100uF 50 Volts 20% Source: Datasheet; ARROW_PART_NUMBER: UFW1H101MPD1TD; ARROW_PRICE-STOCK: https://www.arrow.com/en/products/ufw1h101mpd1td/nichicon; DESCRIPTION: Aluminum Electrolytic Capacitors - Radial Leaded 100uF 50 Volts 20%; HEIGHT: 13mm; MANUFACTURER_NAME: Nichicon; MANUFACTURER_PART_NUMBER: UFW1H101MPD1TD; MOUSER_PART_NUMBER: 647-UFW1H101MPD1TD; MOUSER_PRICE-STOCK: https://www.mouser.co.uk/ProductDetail/Nichicon/UFW1H101MPD1TD?qs=WJSLByB5Mu30jPPJ2KiG3A%3D%3D
C18A C18B C18B2 C18B4 C18B6 C18D C26A C26A1 C27A C27A1 = Dual Mono Amp Library:EMK212ABJ475KG-T: Taiyo Yuden 4.7uF Multilayer Ceramic Capacitor MLCC 16V dc +/-10% X5R Dielectric 0805 SMD, Max. Temp. +85C Source: Datasheet; DESCRIPTION: Taiyo Yuden 4.7uF Multilayer Ceramic Capacitor MLCC 16V dc +/-10% X5R Dielectric 0805 SMD, Max. Temp. +85C; HEIGHT: 1.4mm; MANUFACTURER_NAME: TAIYO YUDEN; MANUFACTURER_PART_NUMBER: EMK212ABJ475KG-T; MOUSER_PART_NUMBER: 963-EMK212ABJ475KG-T; MOUSER_PRICE-STOCK: https://www.mouser.co.uk/ProductDetail/Taiyo-Yuden/EMK212ABJ475KG-T?qs=Va%252BXcMGJzEtDqSLhA2RQmA%3D%3D
C19A C19B C19B2 C19B4 C19B6 C19D = Dual Mono Amp Library:EMK316BB7226ML-T: Multilayer Ceramic Capacitors MLCC - SMD/SMT 22uF 16V X7R +/-20% 1206 Gen Purp Source: Datasheet; DESCRIPTION: Multilayer Ceramic Capacitors MLCC - SMD/SMT 22uF 16V X7R +/-20% 1206 Gen Purp; HEIGHT: 1.8mm; MANUFACTURER_NAME: TAIYO YUDEN; MANUFACTURER_PART_NUMBER: EMK316BB7226ML-T; MOUSER_PART_NUMBER: 963-EMK316BB7226ML-T; MOUSER_PRICE-STOCK: https://www.mouser.co.uk/ProductDetail/TAIYO-YUDEN/EMK316BB7226ML-T?qs=EPmvyOv1YlPvyo1ebMxtFg%3D%3D
C20A C20B C20B2 C20B4 C20B6 C20D = Dual Mono Amp Library:EMK212BB7106KG-T: Multilayer Ceramic Capacitors MLCC - SMD/SMT 10uF 16V X7R 10% 0805 Source: Datasheet; DESCRIPTION: Multilayer Ceramic Capacitors MLCC - SMD/SMT 10uF 16V X7R 10% 0805; HEIGHT: 1.35mm; MANUFACTURER_NAME: TAIYO YUDEN; MANUFACTURER_PART_NUMBER: EMK212BB7106KG-T; MOUSER_PART_NUMBER: 963-EMK212BB7106KG-T; MOUSER_PRICE-STOCK: https://www.mouser.co.uk/ProductDetail/TAIYO-YUDEN/EMK212BB7106KG-T?qs=vF%252B8ahGVilemLVRka0hELA%3D%3D
C21A C21B C21B2 C21B4 C21B6 C21D C28A C28A1 = Dual Mono Amp Library:EMF212B7104KGHT: Multilayer Ceramic Capacitors MLCC - SMD/SMT 0805 16VDC 0.1uF 10% X7R AEC-Q200 Source: Datasheet; DESCRIPTION: Multilayer Ceramic Capacitors MLCC - SMD/SMT 0805 16VDC 0.1uF 10% X7R AEC-Q200; HEIGHT: 1.35mm; MANUFACTURER_NAME: TAIYO YUDEN; MANUFACTURER_PART_NUMBER: EMF212B7104KGHT; MOUSER_PART_NUMBER: 963-EMF212B7104KGHT; MOUSER_PRICE-STOCK: https://www.mouser.co.uk/ProductDetail/Taiyo-Yuden/EMF212B7104KGHT?qs=%252B6g0mu59x7JRGtoE3odDgw%3D%3D
C21O C21O1 = Dual Mono Amp Library:DCP4G056007GD4KSSD: Metallized Polypropylene Capacitor Source: Datasheet; DESCRIPTION: Metallized Polypropylene Capacitor; HEIGHT: 39.5mm; MANUFACTURER_NAME: WIMA; MANUFACTURER_PART_NUMBER: DCP4G056007GD4KSSD; MOUSER_PART_NUMBER: 505-DCP4G056007GD4KS; MOUSER_PRICE-STOCK: https://www.mouser.co.uk/ProductDetail/WIMA/DCP4G056007GD4KSSD?qs=RB4whv9F6ryIMjVzuPTkgw%3D%3D
D1-D6 = Dual Mono Amp Library:1N4148-T50R: Diodes - General Purpose, Power, Switching Hi Conductance Fast Source: Datasheet; DESCRIPTION: Diodes - General Purpose, Power, Switching Hi Conductance Fast; HEIGHT: mm; MANUFACTURER_NAME: onsemi; MANUFACTURER_PART_NUMBER: 1N4148-T50R; MOUSER_PART_NUMBER: 512-1N4148T50R; MOUSER_PRICE-STOCK: https://www.mouser.co.uk/ProductDetail/onsemi-Fairchild/1N4148-T50R?qs=0lQeLiL1qyZS6rosZp7Ehg%3D%3D
D7-D22 = 1N4007FFG:1N4007FFG: Rectifiers 1000V 1A Standard Source: Datasheet; DESCRIPTION: Rectifiers 1000V 1A Standard; HEIGHT: mm; MANUFACTURER_NAME: onsemi; MANUFACTURER_PART_NUMBER: 1N4007FFG; MOUSER_PART_NUMBER: 863-1N4007FFG; MOUSER_PRICE-STOCK: https://www.mouser.co.uk/ProductDetail/onsemi/1N4007FFG?qs=y2kkmE52mdPFE87Rxbyfgw%3D%3D
IC1 IC2 IC5 IC6 IC8 IC10 = Dual Mono Amp Library:LT3042: LINEAR TECHNOLOGY - LT3042EMSE#PBF - LDO, ADJ, 0.2A, 0V-15V, MSOP-10 Source: Datasheet; DESCRIPTION: LINEAR TECHNOLOGY - LT3042EMSE#PBF - LDO, ADJ, 0.2A, 0V-15V, MSOP-10; HEIGHT: 1.1mm; MANUFACTURER_NAME: Linear Technology; MANUFACTURER_PART_NUMBER: LT3042EMSE#PBF; MOUSER_PART_NUMBER: 584-LT3042EMSE#PBF; MOUSER_PRICE-STOCK: https://www.mouser.co.uk/ProductDetail/Analog-Devices-Linear-Technology/LT3042EMSEPBF?qs=oahfZPh6IAJ3XP16d20ITw%3D%3D
IC3 IC4 = Dual Mono Amp Library:LM1117MPX-5.0_NOPB: Space saving 800-mA low-dropout linear regulator with internal current limit Source: Datasheet; DESCRIPTION: Space saving 800-mA low-dropout linear regulator with internal current limit; HEIGHT: 1.8mm; MANUFACTURER_NAME: Texas Instruments; MANUFACTURER_PART_NUMBER: LM1117MPX-5.0/NOPB; MOUSER_PART_NUMBER: 926-LM1117MPX5.0NOPB; MOUSER_PRICE-STOCK: https://www.mouser.co.uk/ProductDetail/Texas-Instruments/LM1117MPX-5.0-NOPB?qs=X1J7HmVL2ZE1O12Qsl7F9g%3D%3D
J1 J5 J8 J10 J12 J17 = XR2A-0811-N:XR2A-0811-N: IC & Component Sockets Socket DIP Term 8P 7.62mm .25AuPlate Source: Datasheet; ARROW_PART_NUMBER: XR2A-0811-N; ARROW_PRICE-STOCK: https://www.arrow.com/en/products/xr2a-0811-n/omron?region=nac; DESCRIPTION: IC & Component Sockets Socket DIP Term 8P 7.62mm .25AuPlate; HEIGHT: 3.9mm; MANUFACTURER_NAME: Omron Electronics; MANUFACTURER_PART_NUMBER: XR2A-0811-N; MOUSER_PART_NUMBER: 653-XR2A-0811-N; MOUSER_PRICE-STOCK: https://www.mouser.co.uk/ProductDetail/Omron-Electronics/XR2A-0811-N?qs=WOBxwZpV8jWLu7CcbwkK0Q%3D%3D
J2 J13 = Dual Mono Amp Library:CONN_06: Multi connection point. Often used as Generic Header-pin footprint for 0.1 inch spaced/style header connections On any of the 0.1 inch spaced packages, you can populate with these: Break Away Headers - Straight (PRT-00116) Break Away Male Headers - Right Angle (PRT-00553) Female Headers (PRT-00115) Break Away Headers - Machine Pin (PRT-00117) Break Away Female Headers - Swiss Machine Pin (PRT-00743) Arduino Stackable Header - 6 Pin (PRT-09280) Screw Terminals 2.54mm Pitch (6-Pin) (PRT-16499) For SCREWTERMINALS and SPRING TERMINALS visit here: Screw Terimnals on SparkFun.com (5mm/3.5mm/2.54mm spacing) This device is also useful as a general connection point to wire up your design to another part of your project. Our various solder wires solder well into these plated through hole pads. Hook-Up Wire - Assortment (Stranded, 22 AWG) (PRT-11375) Hook-Up Wire - Assortment (Solid Core, 22 AWG) (PRT-11367) View the entire wire category on our website here; PROD_ID: CONN-08437
J3 = Dual Mono Amp Library:SJ-63033A: 6.35 mm, Stereo, Right Angle, Through Hole Mount, 3 Conductors, 0 Internal Switches, Audio Jack Connector Source: Datasheet; DESCRIPTION: 6.35 mm, Stereo, Right Angle, Through Hole Mount, 3 Conductors, 0 Internal Switches, Audio Jack Connector; HEIGHT: 12.3mm; MANUFACTURER_NAME: CUI Devices; MANUFACTURER_PART_NUMBER: SJ-63033A
J4 = 1935255:1935255: Phoenix Contact PT 1.5/11-5.0-H PCB Terminal Block, 11 Way/Pole, Screw Terminals, 26 14 AWG Through Hole, Source: Datasheet; DESCRIPTION: Phoenix Contact PT 1.5/11-5.0-H PCB Terminal Block, 11 Way/Pole, Screw Terminals, 26 14 AWG Through Hole,; HEIGHT: 11.55mm; MANUFACTURER_NAME: Phoenix Contact; MANUFACTURER_PART_NUMBER: 1935255; MOUSER_PART_NUMBER: 651-1935255; MOUSER_PRICE-STOCK: https://www.mouser.co.uk/ProductDetail/Phoenix-Contact/1935255?qs=wd%252Bw3mUqFrm1E513uD0TOQ%3D%3D
J6 = Dual Mono Amp Library:1935255: Phoenix Contact PT 1.5/11-5.0-H PCB Terminal Block, 11 Way/Pole, Screw Terminals, 26 14 AWG Through Hole, Source: Datasheet; DESCRIPTION: Phoenix Contact PT 1.5/11-5.0-H PCB Terminal Block, 11 Way/Pole, Screw Terminals, 26 14 AWG Through Hole,; HEIGHT: 11.55mm; MANUFACTURER_NAME: Phoenix Contact; MANUFACTURER_PART_NUMBER: 1935255; MOUSER_PART_NUMBER: 651-1935255; MOUSER_PRICE-STOCK: https://www.mouser.co.uk/ProductDetail/Phoenix-Contact/1935255?qs=wd%252Bw3mUqFrm1E513uD0TOQ%3D%3D
J7 = Dual Mono Amp Library:1935200: Fixed Terminal Blocks PT 1.5/6-5.0-H Source: Datasheet; DESCRIPTION: Fixed Terminal Blocks PT 1.5/6-5.0-H; HEIGHT: 11.55mm; MANUFACTURER_NAME: Phoenix Contact; MANUFACTURER_PART_NUMBER: 1935200; MOUSER_PART_NUMBER: 651-1935200; MOUSER_PRICE-STOCK: https://www.mouser.co.uk/ProductDetail/Phoenix-Contact/1935200?qs=8BCRtFWWXOTOyOTMiNRITA%3D%3D
J9 = 1935200:1935200: Fixed Terminal Blocks PT 1.5/6-5.0-H Source: Datasheet; DESCRIPTION: Fixed Terminal Blocks PT 1.5/6-5.0-H; HEIGHT: 11.55mm; MANUFACTURER_NAME: Phoenix Contact; MANUFACTURER_PART_NUMBER: 1935200; MOUSER_PART_NUMBER: 651-1935200; MOUSER_PRICE-STOCK: https://www.mouser.co.uk/ProductDetail/Phoenix-Contact/1935200?qs=8BCRtFWWXOTOyOTMiNRITA%3D%3D
LDO1 LDO7 = Dual Mono Amp Library:LP5907-1.8V: 250-mA ultra-low-noise low-IQ low-dropout (LDO) linear regulator Source: Datasheet; ARROW_PART_NUMBER: LP5907MFX-1.8/NOPB; ARROW_PRICE-STOCK: https://www.arrow.com/en/products/lp5907mfx-1.8nopb/texas-instruments?region=nac; DESCRIPTION: 250-mA ultra-low-noise low-IQ low-dropout (LDO) linear regulator; HEIGHT: 1.45mm; MANUFACTURER_NAME: Texas Instruments; MANUFACTURER_PART_NUMBER: LP5907MFX-1.8/NOPB; MOUSER_PART_NUMBER: 595-LP5907MFX-1.8NPB; MOUSER_PRICE-STOCK: https://www.mouser.co.uk/ProductDetail/Texas-Instruments/LP5907MFX-1.8-NOPB?qs=biyDIajrTn5jh5ArkSZeqw%3D%3D
R1-R4 R7 R8 R13 R14 = Dual Mono Amp Library:LR1F1K0: Body Features: Lead Type Axial-Leaded | Configuration Features: Number of Resistors 1 | Dimensions: Passive Component Dimensions 6.2 x 2.3 MM | Electrical Characteristics: Passive Component Tolerance 1 PCT | Resistance Value 1K OHM | Operating Voltage 350 V | Power Rating .6 WATT | Resistance Class 1k 1M | Packaging Features: Packaging Method Ammo Packed | Product Type Features: Element Type Thin Film | Resistor Type General Purpose Resistor | Termination Features: Termination Area Base Material Cop Source: Datasheet; DESCRIPTION: Body Features: Lead Type Axial-Leaded | Configuration Features: Number of Resistors 1 | Dimensions: Passive Component Dimensions 6.2 x 2.3 MM | Electrical Characteristics: Passive Component Tolerance 1 PCT | Resistance Value 1K OHM | Operating Voltage 350 V | Power Rating .6 WATT | Resistance Class 1k 1M | Packaging Features: Packaging Method Ammo Packed | Product Type Features: Element Type Thin Film | Resistor Type General Purpose Resistor | Termination Features: Termination Area Base Material Cop; HEIGHT: mm; MANUFACTURER_NAME: TE Connectivity; MANUFACTURER_PART_NUMBER: LR1F1K0; MOUSER_PART_NUMBER: 279-LR1F1K0; MOUSER_PRICE-STOCK: https://www.mouser.co.uk/ProductDetail/TE-Connectivity-Holsworthy/LR1F1K0?qs=ip69W3eHERVhMxNSZkerTg%3D%3D
R2P R2P1 R3P R3P1 R4P R4P1 R5P R5P1 R6P R6P1-R6P3 = rcl:R-US_: RESISTOR, American symbol; SPICEPREFIX: R
R3O R3O1 = Dual Mono Amp Library:LR1F1M0: TE Connectivity Axial Metal Film Resistor 1m +/-1% 0.6W +/-50ppm/C Source: Datasheet; DESCRIPTION: TE Connectivity Axial Metal Film Resistor 1m +/-1% 0.6W +/-50ppm/C; HEIGHT: mm; MANUFACTURER_NAME: TE Connectivity; MANUFACTURER_PART_NUMBER: LR1F1M0; MOUSER_PART_NUMBER: 279-LR1F1M0; MOUSER_PRICE-STOCK: https://www.mouser.co.uk/ProductDetail/TE-Connectivity-Holsworthy/LR1F1M0?qs=ip69W3eHERVt%2FmQVAugcSg%3D%3D
R5 R11 R19 R20 = Dual Mono Amp Library:CPF215K000FKE14: VISHAY - CPF215K000FKE14 - Through Hole Resistor, 15 kohm, CPF Series, 2 W, +/- 1%, Axial Leaded, 500 V Source: Datasheet; DESCRIPTION: VISHAY - CPF215K000FKE14 - Through Hole Resistor, 15 kohm, CPF Series, 2 W, +/- 1%, Axial Leaded, 500 V; HEIGHT: mm; MANUFACTURER_NAME: Vishay; MANUFACTURER_PART_NUMBER: CPF215K000FKE14; MOUSER_PART_NUMBER: 71-CPF2-F-15K-E3; MOUSER_PRICE-STOCK: https://www.mouser.com/ProductDetail/71-CPF2-F-15K-E3
R6A R6B R6B2 R6B4 R6B6 R6D = Dual Mono Amp Library:CHP0805-FX-1001ELF: BOURNS - CHP0805-FX-1001ELF - SMD Chip Resistor, 0805 [2012 Metric], 1 kohm, CHP Series, 200 V, Thick Film, 500 mW Source: Datasheet; DESCRIPTION: BOURNS - CHP0805-FX-1001ELF - SMD Chip Resistor, 0805 [2012 Metric], 1 kohm, CHP Series, 200 V, Thick Film, 500 mW; HEIGHT: 0.6mm; MANUFACTURER_NAME: Bourns; MANUFACTURER_PART_NUMBER: CHP0805-FX-1001ELF; MOUSER_PART_NUMBER: 652-CHP0805FX1001ELF; MOUSER_PRICE-STOCK: https://www.mouser.co.uk/ProductDetail/Bourns/CHP0805-FX-1001ELF?qs=lc2O%252BfHJPVYkHmuBCgSoNQ%3D%3D
R7A R7B R7B2 R7B4 R7B6 R7D = Dual Mono Amp Library:CPF0805B51KE1: NEOHM - TE CONNECTIVITY - CPF0805B51KE1 - SMD Chip Resistor, 51 kohm, +/- 0.1%, 100 mW, 0805 [2012 Metric], Thin Film, Precision Low TCR Source: Datasheet; DESCRIPTION: NEOHM - TE CONNECTIVITY - CPF0805B51KE1 - SMD Chip Resistor, 51 kohm, +/- 0.1%, 100 mW, 0805 [2012 Metric], Thin Film, Precision Low TCR; HEIGHT: 0.65mm; MANUFACTURER_NAME: TE Connectivity; MANUFACTURER_PART_NUMBER: CPF0805B51KE1; MOUSER_PART_NUMBER: 279-CPF0805B51KE1; MOUSER_PRICE-STOCK: https://www.mouser.co.uk/ProductDetail/TE-Connectivity-Holsworthy/CPF0805B51KE1?qs=iJVBkmKXgrkfOCLIw017vA%3D%3D
R8A R8B R8B2 R8B4 R8B6 R8D = Dual Mono Amp Library:RR1220P-204-D: RESISTOR, 0805 200 KOhm +/- 0.5% 0.1 W Source: Datasheet; DESCRIPTION: RESISTOR, 0805 200 KOhm +/- 0.5% 0.1 W; HEIGHT: mm; MANUFACTURER_NAME: Susumu; MANUFACTURER_PART_NUMBER: RR1220P-204-D; MOUSER_PART_NUMBER: 754-RR1220P-204D; MOUSER_PRICE-STOCK: https://www.mouser.com/Search/Refine.aspx?Keyword=754-RR1220P-204D
R9 R15 = Dual Mono Amp Library:MBB02070C2490FRP00: Metal Film Resistors - Through Hole 249ohm 1% 0.6W Metal Film Resistor Source: Datasheet; DESCRIPTION: Metal Film Resistors - Through Hole 249ohm 1% 0.6W Metal Film Resistor; HEIGHT: mm; MANUFACTURER_NAME: VISHAY; MANUFACTURER_PART_NUMBER: MBB02070C2490FRP00
R10 R16 = Dual Mono Amp Library:YR1B76R8CC: Body Features: Lead Type Axial-Leaded | Configuration Features: Number of Resistors 1 | Dimensions: Passive Component Dimensions 6.3 x 2.3 MM | Electrical Characteristics: Resistance Class Up to 1k | Power Rating .25 WATT | Operating Voltage 250 V | Passive Component Tolerance .1 PCT | Resistance Value 76.8 OHM | Packaging Features: Packaging Method Ammo Packed | Product Type Features: Resistor Type Precision Resistor | Element Type Thin Film | Termination Features: Number of Terminations 2 | Termination Source: Datasheet; DESCRIPTION: Body Features: Lead Type Axial-Leaded | Configuration Features: Number of Resistors 1 | Dimensions: Passive Component Dimensions 6.3 x 2.3 MM | Electrical Characteristics: Resistance Class Up to 1k | Power Rating .25 WATT | Operating Voltage 250 V | Passive Component Tolerance .1 PCT | Resistance Value 76.8 OHM | Packaging Features: Packaging Method Ammo Packed | Product Type Features: Resistor Type Precision Resistor | Element Type Thin Film | Termination Features: Number of Terminations 2 | Termination; HEIGHT: mm; MANUFACTURER_NAME: TE Connectivity; MANUFACTURER_PART_NUMBER: YR1B76R8CC
R11O R19O R20O R20O1 R20O2 R21O R22O R28O R29O R30O = Dual Mono Amp Library:LR1F10K: Metal film resistor, 10K 0.6W TE Connectivity LR1F Series Axial Metal Film Resistor 10k Source: Datasheet; DESCRIPTION: Metal film resistor, 10K 0.6W TE Connectivity LR1F Series Axial Metal Film Resistor 10k; HEIGHT: mm; MANUFACTURER_NAME: TE Connectivity; MANUFACTURER_PART_NUMBER: LR1F10K; MOUSER_PART_NUMBER: 279-LR1F10K; MOUSER_PRICE-STOCK: https://www.mouser.co.uk/ProductDetail/TE-Connectivity-Holsworthy/LR1F10K?qs=ip69W3eHERWDLLWs2Qv0Lg%3D%3D
R12O R14O R16O R18O R23O R24O R25O R26O = Dual Mono Amp Library:MF0207FTE52-182R: Metal Film Resistors - Through Hole 0.6W 1% 182 ohm 50pp m Source: Datasheet; DESCRIPTION: Metal Film Resistors - Through Hole 0.6W 1% 182 ohm 50pp m; HEIGHT: mm; MANUFACTURER: Yageo; MANUFACTURER_PART_NUMBER: MF0207FTE52-182R; MOUSER_PART_NUMBER: 603-MF0207FTE52-182R; MOUSER_PRICE-STOCK: https://www.mouser.com/ProductDetail/YAGEO/MF0207FTE52-182R?qs=KUIzHt%2Fe91leK267FaM40g%3D%3D
R17 R18 = Dual Mono Amp Library:RWR80S4020FRB12: Metal Film Resistors - Through Hole 402 OHM 2W 1% Source: Datasheet; DESCRIPTION: Metal Film Resistors - Through Hole 402 OHM 2W 1%; HEIGHT: mm; MANUFACTURER_NAME: VISHAY; MANUFACTURER_PART_NUMBER: RWR80S4020FRB12
SH1 SH2 = Dual Mono Amp Library:SHORT: Short between two nets; BOM: No; DESCRIPTION: Short between two nets
SX1-SX4 = Dual Mono Amp Library:VT9: VACUUM TUBE SOCKET Source: 00004280-VT9-PT.pdf
U1 U2 = Dual Mono Amp Library:LM317MTG: Internal Short Circuit Current Limiting; Internal Thermal Overload Protection; Output Current in Excess of 500 mA; Output Transistor Safe-Area Compensation; Output Adjustable between 1.2 V and 37 V; Floating Operation for High Voltage Applications; Eliminates Stocking Many Fixed Voltages; Pb-Free Packages are Available; NCV Prefix for Automotive and Other Applications Requiring Site Control Changes Source: Datasheet; DESCRIPTION: Internal Short Circuit Current Limiting, Internal Thermal Overload Protection, Output Current in Excess of 500 mA, Output Transistor Safe-Area Compensation, Output Adjustable between 1.2 V and 37 V, Floating Operation for High Voltage Applications, Pb-Free Packages are Available; HEIGHT: 4.82mm; MANUFACTURER_NAME: onsemi; MANUFACTURER_PART_NUMBER: LM317MTG; MOUSER_PART_NUMBER: 863-LM317MTG; MOUSER_PRICE-STOCK: https://www.mouser.co.uk/ProductDetail/onsemi/LM317MTG?qs=2OtswVQKCOHbXYkL9fERIw%3D%3D
Z1 Z2 Z5 Z6 = Dual Mono Amp Library:BZX79-C16,113: Nexperia Zener Diode, 16V +/-2 %, +/-5 % 500 mW Through Hole 2-Pin SOD27 (DO-35) Source: Datasheet; DESCRIPTION: Nexperia Zener Diode, 16V +/-2 %, +/-5 % 500 mW Through Hole 2-Pin SOD27 (DO-35); HEIGHT: mm; MANUFACTURER_NAME: Nexperia; MANUFACTURER_PART_NUMBER: BZX79-C16,113
Z3 Z4 = Dual Mono Amp Library:1N750: Zener Diodes Voltage Regulator Source: Datasheet; DESCRIPTION: Zener Diodes Voltage Regulator; HEIGHT: mm; MANUFACTURER_NAME: Microsemi Corporation; MANUFACTURER_PART_NUMBER: 1N750; MOUSER_PART_NUMBER: 494-1N750(DO-35); MOUSER_PRICE-STOCK: https://www.mouser.co.uk/ProductDetail/Microchip-Microsemi/1N750?qs=Xwz%252BGKGy4sB1rzIdx4SmVg%3D%3D

## Net classes
1 Signal: width 1.27 mm
2 Power: width 2.54 mm